# EAGLE design MiniBus (EAGLE 6.5.0)
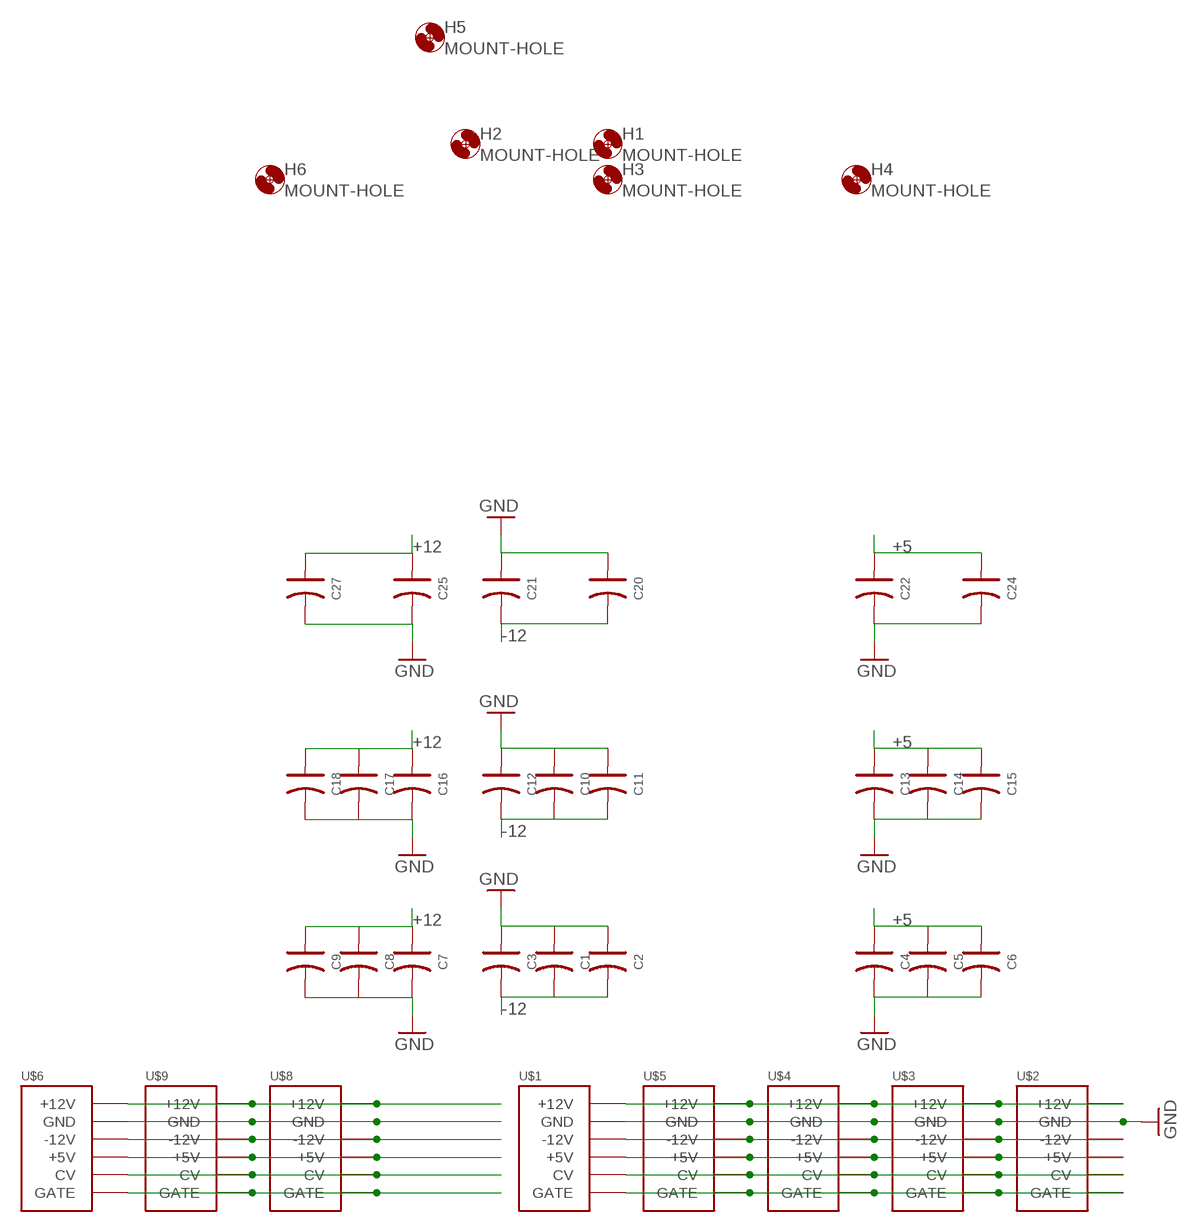
[diagram p0: schematic, sheet 1]

## Parts
C1  C-POLAR-A  [AVX-A]
C2  C-POLAR-A  [AVX-A]
C3  C-POLAR-A  [AVX-A]
C4  C-POLAR-A  [AVX-A]
C5  C-POLAR-A  [AVX-A]
C6  C-POLAR-A  [AVX-A]
C7  C-POLAR-A  [AVX-A]
C8  C-POLAR-A  [AVX-A]
C9  C-POLAR-A  [AVX-A]
C10  C-POLAR-A  [AVX-A]
C11  C-POLAR-A  [AVX-A]
C12  C-POLAR-A  [AVX-A]
C13  C-POLAR-A  [AVX-A]
C14  C-POLAR-A  [AVX-A]
C15  C-POLAR-A  [AVX-A]
C16  C-POLAR-A  [AVX-A]
C17  C-POLAR-A  [AVX-A]
C18  C-POLAR-A  [AVX-A]
C20  C-POLAR-A  [AVX-A]
C21  C-POLAR-A  [AVX-A]
C22  C-POLAR-A  [AVX-A]
C24  C-POLAR-A  [AVX-A]
C25  C-POLAR-A  [AVX-A]
C27  C-POLAR-A  [AVX-A]
H1  MOUNT-HOLE  [3.2-NOMARKINGS-SMALLSAFEZONE]
H2  MOUNT-HOLE  [3.2-NOMARKINGS-SMALLSAFEZONE]
H3  MOUNT-HOLE  [3.2-NOMARKINGS-SMALLSAFEZONE]
H4  MOUNT-HOLE  [3.2-NOMARKINGS-SMALLSAFEZONE]
H5  MOUNT-HOLE  [3.2-NOMARKINGS-SMALLSAFEZONE]
H6  MOUNT-HOLE  [3.2-NOMARKINGS-SMALLSAFEZONE]
U$1  POWER  [POWER_16]
U$2  POWER  [POWER_16]
U$3  POWER  [POWER_16]
U$4  POWER  [POWER_16]
U$5  POWER  [POWER_16]
U$6  POWER  [POWER_16]
U$8  POWER  [POWER_16]
U$9  POWER  [POWER_16]

## Nets
+5: C4.+ C5.+ C6.+ C13.+ C14.+ C15.+ C22.+ C24.+ U$1.11(+5V) U$1.12(+5V) U$2.11(+5V) U$2.12(+5V) U$3.11(+5V) U$3.12(+5V) U$4.11(+5V) U$4.12(+5V) U$5.11(+5V) U$5.12(+5V) U$6.11(+5V) U$6.12(+5V) U$8.11(+5V) U$8.12(+5V) U$9.11(+5V) U$9.12(+5V)
+12: C7.+ C8.+ C9.+ C16.+ C17.+ C18.+ C25.+ C27.+ U$1.9(+12V) U$1.10(+12V) U$2.9(+12V) U$2.10(+12V) U$3.9(+12V) U$3.10(+12V) U$4.9(+12V) U$4.10(+12V) U$5.9(+12V) U$5.10(+12V) U$6.9(+12V) U$6.10(+12V) U$8.9(+12V) U$8.10(+12V) U$9.9(+12V) U$9.10(+12V)
-12: C1.- C2.- C3.- C10.- C11.- C12.- C20.- C21.- U$1.1(-12V) U$1.2(-12V) U$2.1(-12V) U$2.2(-12V) U$3.1(-12V) U$3.2(-12V) U$4.1(-12V) U$4.2(-12V) U$5.1(-12V) U$5.2(-12V) U$6.1(-12V) U$6.2(-12V) U$8.1(-12V) U$8.2(-12V) U$9.1(-12V) U$9.2(-12V)
CV: U$1.13(CV) U$1.14(CV) U$2.13(CV) U$2.14(CV) U$3.13(CV) U$3.14(CV) U$4.13(CV) U$4.14(CV) U$5.13(CV) U$5.14(CV) U$6.13(CV) U$6.14(CV) U$8.13(CV) U$8.14(CV) U$9.13(CV) U$9.14(CV)
GATE: U$1.15(GATE) U$1.16(GATE) U$2.15(GATE) U$2.16(GATE) U$3.15(GATE) U$3.16(GATE) U$4.15(GATE) U$4.16(GATE) U$5.15(GATE) U$5.16(GATE) U$6.15(GATE) U$6.16(GATE) U$8.15(GATE) U$8.16(GATE) U$9.15(GATE) U$9.16(GATE)
GND: C1.+ C2.+ C3.+ C4.- C5.- C6.- C7.- C8.- C9.- C10.+ C11.+ C12.+ C13.- C14.- C15.- C16.- C17.- C18.- C20.+ C21.+ C22.- C24.- C25.- C27.- U$1.3(GND) U$1.4(GND) U$1.5(GND) U$1.6(GND) U$1.7(GND) U$1.8(GND) U$2.3(GND) U$2.4(GND) U$2.5(GND) U$2.6(GND) U$2.7(GND) U$2.8(GND) U$3.3(GND) U$3.4(GND) U$3.5(GND) U$3.6(GND) U$3.7(GND) U$3.8(GND) U$4.3(GND) U$4.4(GND) U$4.5(GND) U$4.6(GND) U$4.7(GND) U$4.8(GND) U$5.3(GND) U$5.4(GND) U$5.5(GND) U$5.6(GND) U$5.7(GND) U$5.8(GND) U$6.3(GND) U$6.4(GND) U$6.5(GND) U$6.6(GND) U$6.7(GND) U$6.8(GND) U$8.3(GND) U$8.4(GND) U$8.5(GND) U$8.6(GND) U$8.7(GND) U$8.8(GND) U$9.3(GND) U$9.4(GND) U$9.5(GND) U$9.6(GND) U$9.7(GND) U$9.8(GND)

## Library data of the parts
C1-C18 C20-C22 C24 C25 C27 = OPL:C-POLAR*
H1-H6 = zephod-components:MOUNT-HOLE: MOUNTING HOLE with drill center marker
U$1-U$6 U$8 U$9 = EurorackModularParts:POWER

## Net classes
0 default: width 0.508 mm

## Board
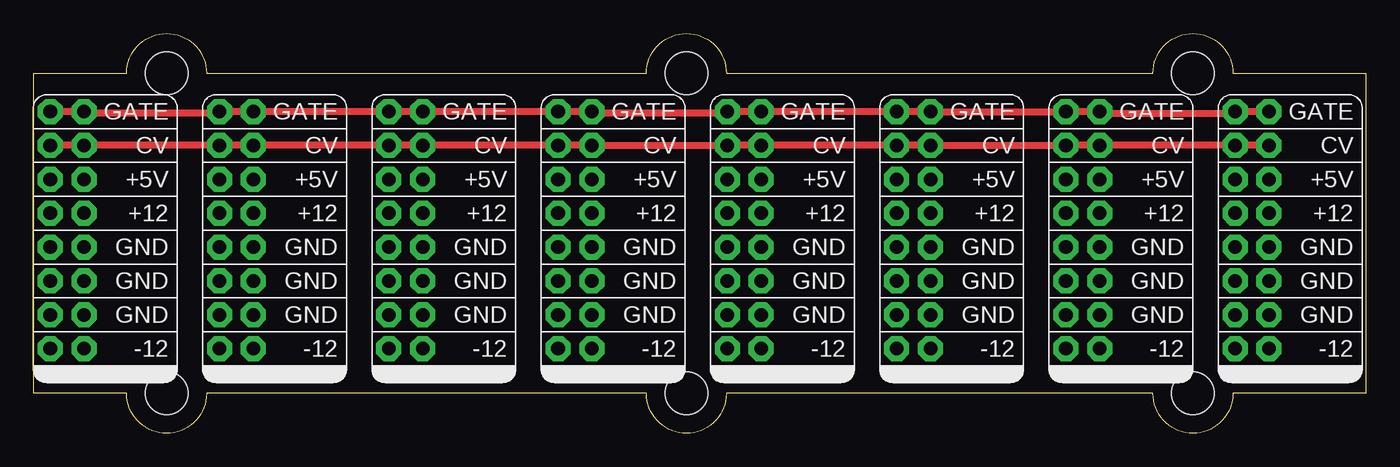
[diagram p1: board, top side]
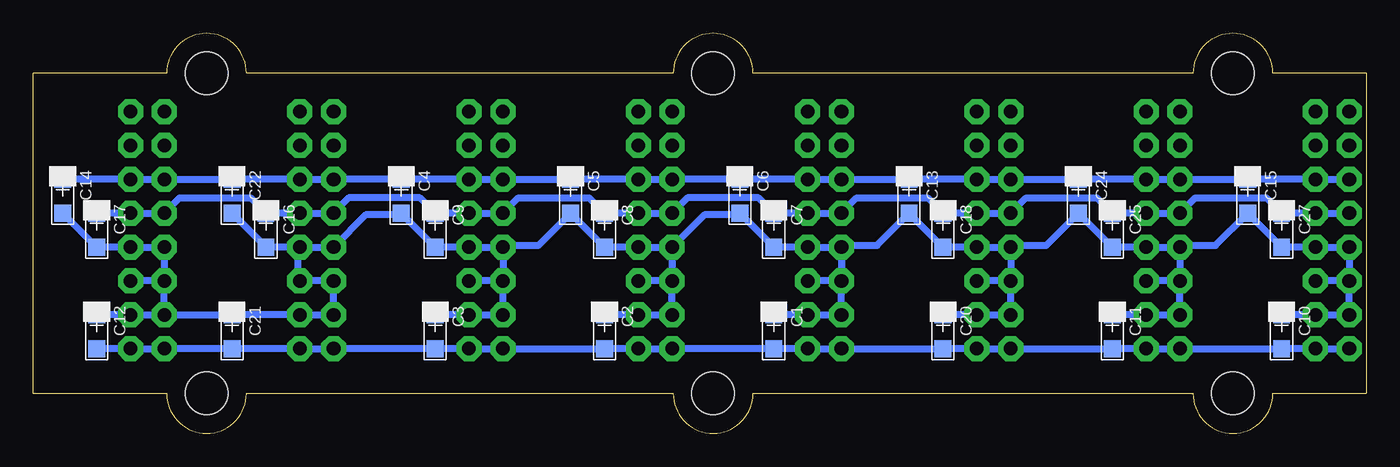
[diagram p2: board, bottom side, seen from below]

Size 100 x 30 mm. Coordinates in mm from the lower left corner, seen from the top.
Outline: 100,3 100,27 90,27 arc90 87,30 arc90 84,27 52,27 arc90 49,30 arc90 46,27 13,27 arc90 10,30 arc90 7,27 0,27 0,3 7,3 arc90 10,0 arc90 13,3 46,3 arc90 49,0 arc90 52,3 84,3 arc90 87,0 arc90 90,3 100,3
Copper layers (1*16): Top 0.035mm / dielectric 1.5mm / Bottom 0.035mm
Design rules "default": minimum track width 10mil, minimum drill 24mil, track to track 8mil, track to pad 8mil, pad to pad 8mil, via to via 8mil, smd to smd 8mil, copper to edge 40mil, drill to drill 8mil, minimum pad ring 10mil, minimum via ring 8mil, stop-mask expansion 4mil, vias tented up to drill 0mil, thermal gap 10mil

### Footprints (pad centres in the part's own frame; a part is rotated, then mirrored left to right if it is on the bottom)
AVX-A = smd 1.27 x 1.27: + -1.27,0; - 1.27,0
3.2-NOMARKINGS-SMALLSAFEZONE = hole 3.2: 0,0
POWER_16 = drill 1.016 pad 1.88 octagon: 1 -6.35,-1.27; 2 -6.35,1.27; 3 -3.81,-1.27; 4 -3.81,1.27; 5 -1.27,-1.27; 6 -1.27,1.27; 7 1.27,-1.27; 8 1.27,1.27; 9 3.81,-1.27; 10 3.81,1.27; 11 6.35,-1.27; 12 6.35,1.27; 13 8.89,-1.27; 14 8.89,1.27; 15 11.43,-1.27; 16 11.43,1.27

### Placement (x,y rotation side)
C1  44.45,7.62 270 bottom
C2  57.15,7.62 270 bottom
C3  69.85,7.62 270 bottom
C4  72.39,17.78 270 bottom
C5  59.69,17.78 270 bottom
C6  46.99,17.78 270 bottom
C7  44.45,15.24 270 bottom
C8  57.15,15.24 270 bottom
C9  69.85,15.24 270 bottom
C10  6.35,7.62 270 bottom
C11  19.05,7.62 270 bottom
C12  95.25,7.62 270 bottom
C13  34.29,17.78 270 bottom
C14  97.79,17.78 270 bottom
C15  8.89,17.78 270 bottom
C16  82.55,15.24 270 bottom
C17  95.25,15.24 270 bottom
C18  31.75,15.24 270 bottom
C20  31.75,7.62 270 bottom
C21  85.09,7.62 270 bottom
C22  85.09,17.78 270 bottom
C24  21.59,17.78 270 bottom
C25  19.05,15.24 270 bottom
C27  6.35,15.24 270 bottom
H1  10,3 0 top
H2  87,3 0 top
H3  10,27 0 top
H4  87,27 0 top
H5  49,27 0 top
H6  49,3 0 top
U$1  40.64,12.7 90 top
U$2  53.34,12.7 90 top
U$3  66.04,12.7 90 top
U$4  78.74,12.7 90 top
U$5  91.44,12.7 90 top
U$6  27.94,12.7 90 top
U$8  15.24,12.7 90 top
U$9  2.54,12.7 90 top

### Tracks (layer width: path | path; a pad name or v marks a point on that pad's centre or on a via)
+5
  Bottom 0.508: C14.+ U$5.11 U$5.12 C22.+ U$4.11 U$4.12 C4.+ U$3.11 U$3.12 C5.+ U$2.11 U$2.12 C6.+ U$1.11 U$1.12 C13.+ U$6.11 U$6.12 C24.+ U$8.11 U$8.12 C15.+ U$9.11 U$9.12
+12
  Bottom 0.508: C17.+ U$5.9 U$5.10 89.03,17.65 83.69,17.65 C16.+ U$4.9 U$4.10 76.33,17.65 70.99,17.65 C9.+ U$3.9 U$3.10 63.63,17.65 58.29,17.65 C8.+ U$2.9 U$2.10 50.93,17.65 45.59,17.65 C7.+ U$1.9 U$1.10 38.23,17.65 32.89,17.65 C18.+ U$6.9 U$6.10 25.53,17.65 20.19,17.65 C25.+ U$8.9 U$8.10 12.83,17.65 7.49,17.65 C27.+ U$9.9 U$9.10
-12
  Bottom 0.508: C12.- U$5.1 U$5.2 C21.- U$4.1 U$4.2 C3.- U$3.1 U$3.2 C2.- U$2.1 U$2.2 C1.- U$1.1 U$1.2 C20.- U$6.1 U$6.2 C11.- U$8.1 U$8.2 C10.- U$9.1 U$9.2
CV
  Top 0.508: U$5.13 U$5.14 U$4.13 U$4.14 U$3.13 U$3.14 U$2.13 U$2.14 U$1.13 U$1.14 U$6.13 U$6.14 U$8.13 U$8.14 U$9.13 U$9.14
GATE
  Top 0.508: U$9.16 U$9.15 3.94,24 13.84,24 U$8.16 U$8.15 U$6.16 U$6.15 U$1.16 U$1.15 42.04,24 51.94,24 U$2.16 U$2.15 U$3.16 U$3.15 U$4.16 U$4.15 80.14,24 90.04,24 U$5.16 U$5.15
GND
  Bottom 0.508: U$4.7 C16.- C22.- | U$4.7 U$4.8 75.06,16.38 72.52,16.38 C4.- C9.- U$3.7 U$3.8 | U$4.7 80.14,13.84 80.14,11.56 U$4.5 U$4.6 U$4.4 U$4.3 C21.+ U$5.4 | C12.+ U$5.3 U$5.4 | U$5.4 U$5.6 | U$5.6 U$5.5 | C14.- C17.- U$5.7 U$5.8 U$5.6 | C2.+ U$2.3 U$2.4 U$2.6 | U$2.6 U$2.5 | U$2.8 U$2.7 C8.- C5.- 62.1,14.1 64.64,14.1 U$3.8 | U$2.8 U$2.6 | C3.+ U$3.3 U$3.4 U$3.6 | U$3.6 U$3.5 | U$3.8 U$3.6 | C10.+ U$9.3 U$9.4 U$9.6 | U$9.6 U$9.5 | U$9.6 U$9.8 U$9.7 C27.- C15.- 11.3,14.1 13.84,14.1 U$8.8 | C11.+ U$8.3 U$8.4 U$8.6 | U$8.6 U$8.5 | U$8.8 U$8.7 C25.- C24.- 24,14.1 26.54,14.1 U$6.8 | U$8.8 U$8.6 | C20.+ U$6.3 U$6.4 U$6.6 | U$6.6 U$6.5 | U$6.8 U$6.7 C18.- C13.- 36.7,14.1 39.24,14.1 U$1.8 | U$6.8 U$6.6 | C1.+ U$1.3 U$1.4 U$1.6 | U$1.6 U$1.5 | U$1.8 U$1.7 C7.- C6.- 47.12,16.38 49.66,16.38 U$2.8 | U$1.8 U$1.6